# EAGLE design Main Board Germany 2016 (EAGLE 7.6.0)
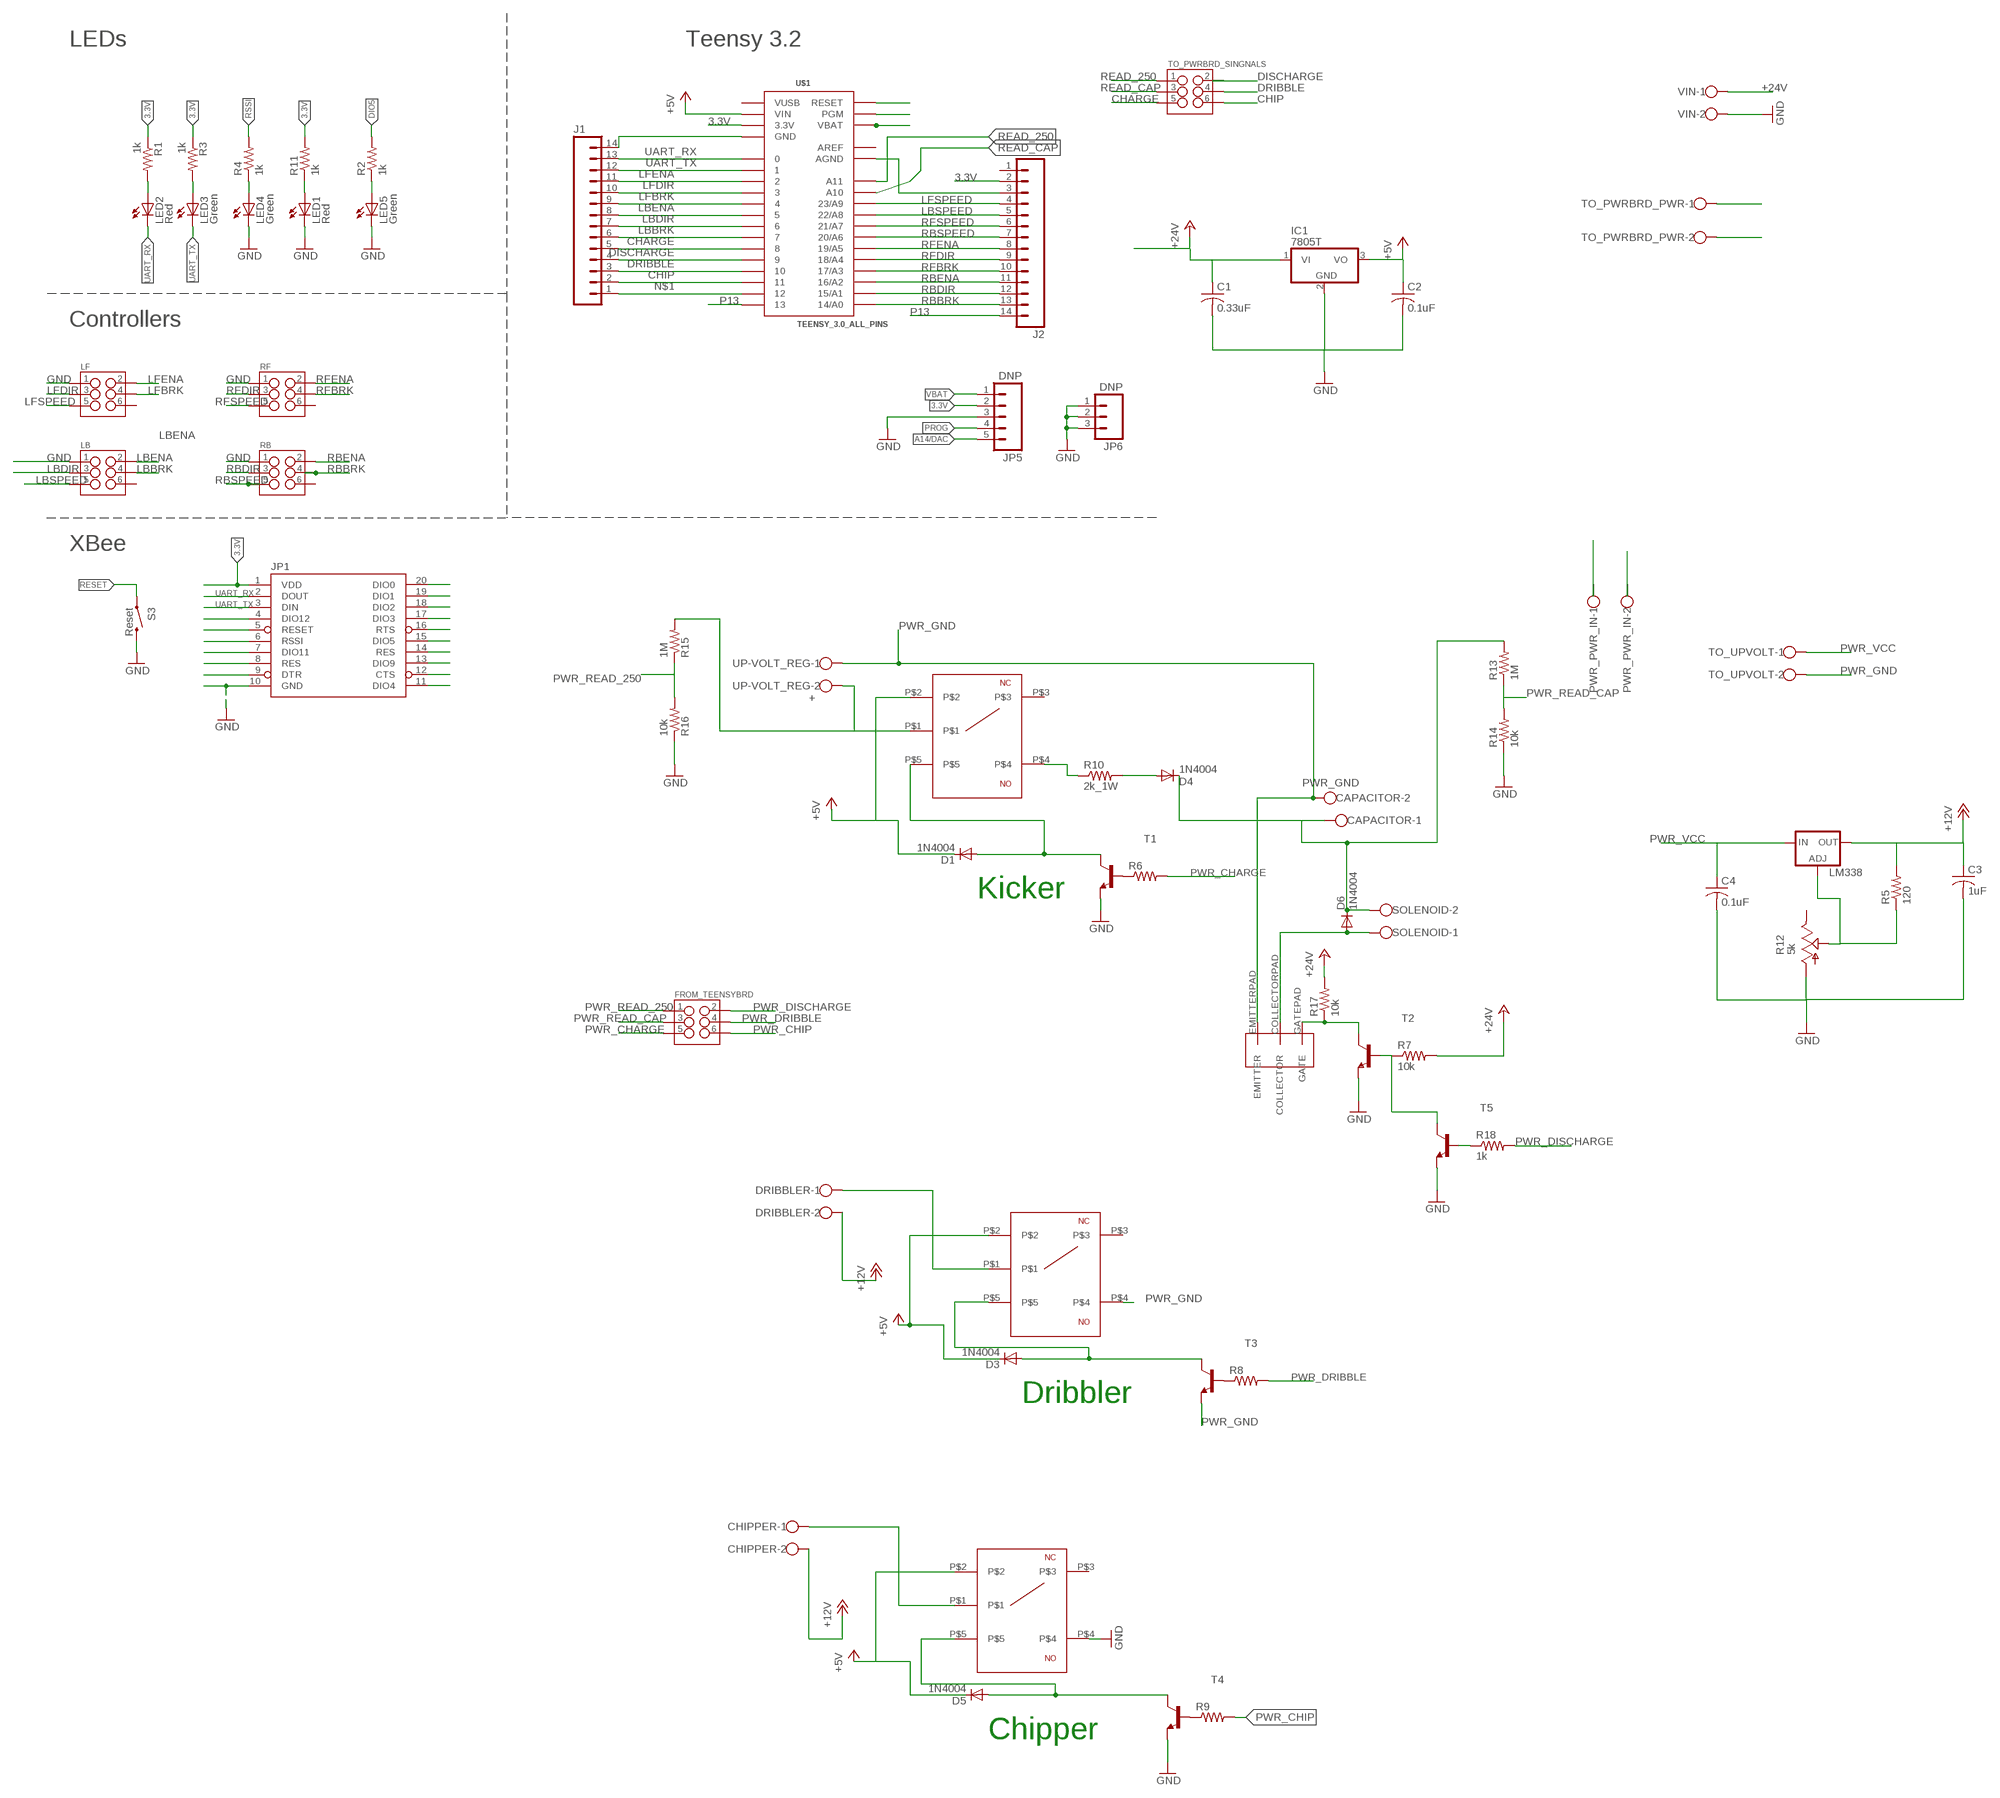
[diagram p0: schematic, sheet 1]

## Parts
C1  0.33uF  C-USC0805  [C0805]
C2  0.1uF  C-USC0805  [C0805]
C3  1uF  C-USC0805  [C0805]
C4  0.1uF  C-USC0805  [C0805]
CAPACITOR  W237-102  [W237-102]
CHIPPER  W237-102  [W237-102]
D1  1N4004  [DO41-10]
D3  1N4004  [DO41-10]
D4  1N4004  [DO41-10]
D5  1N4004  [DO41-10]
D6  1N4004  [DO41-10]
DRIBBLER  W237-102  [W237-102]
FROM_TEENSYBRD  M03X2POGO_PINS  [2X3_POGO]
IC1  7805T  [TO220H]
J1  M14  [1X14]
J2  M14  [1X14]
JP1  XBEE-1B1  [XBEE-1]
JP5  DNP  M05PTH  [1X05]
JP6  DNP  M03PTH  [1X03]
LB  M03X2POGO_PINS  [2X3_POGO]
LED1  Red  LED-RED0603  [LED-0603]
LED2  Red  LED-RED0603  [LED-0603]
LED3  Green  LED-GREEN0603  [LED-0603]
LED4  Green  LED-GREEN0603  [LED-0603]
LED5  Green  LED-GREEN0603  [LED-0603]
LF  M03X2POGO_PINS  [2X3_POGO]
LM338  LM317TL  [317TL]
PWR_PWR_IN  W237-102  [W237-102]
R1  1k  1KOHM1/10W1%(0603)  [0603-RES]
R2  1k  1KOHM1/10W1%(0603)  [0603-RES]
R3  1k  1KOHM1/10W1%(0603)  [0603-RES]
R4  1k  1KOHM1/10W1%(0603)  [0603-RES]
R5  120  R-US_M0805  [M0805]
R6  R-US_0207/7  [0207/7]
R7  10k  R-US_0207/7  [0207/7]
R8  R-US_0207/7  [0207/7]
R9  R-US_0207/7  [0207/7]
R10  2k_1W  R-US_0309/12  [0309/12]
R11  1k  1KOHM1/10W1%(0603)  [0603-RES]
R12  5k  TRIM_US-B25P  [B25P]
R13  1M  R-US_M0805  [M0805]
R14  10k  R-US_M0805  [M0805]
R15  1M  R-US_M0805  [M0805]
R16  10k  R-US_M0805  [M0805]
R17  10k  R-US_0207/7  [0207/7]
R18  1k  R-US_0207/7  [0207/7]
RB  M03X2POGO_PINS  [2X3_POGO]
RF  M03X2POGO_PINS  [2X3_POGO]
S3  Reset  SWITCH-MOMENTARY-2SMD  [TACTILE-SWITCH-SMD]
SOLENOID  W237-102  [W237-102]
T1  2N3904-NPN-TO92-EBC  [TO92-EBC]
T2  2N3904-NPN-TO92-EBC  [TO92-EBC]
T3  2N3904-NPN-TO92-EBC  [TO92-EBC]
T4  2N3904-NPN-TO92-EBC  [TO92-EBC]
T5  2N3904-NPN-TO92-EBC  [TO92-EBC]
TO_PWRBRD_PWR  W237-102  [W237-102]
TO_PWRBRD_SINGNALS  M03X2POGO_PINS  [2X3_POGO]
TO_UPVOLT  W237-102  [W237-102]
U$1  TEENSY_3.0_ALL_PINS  [TEENSY3-ALL_PINS]
U$2  APT75GN120LG  [TO-264]
U$3  PANASONIC_JS1  [PANASONIC_JS1]
U$4  PANASONIC_JS1  [PANASONIC_JS1]
U$5  PANASONIC_JS1  [PANASONIC_JS1]
UP-VOLT_REG  +  W237-102  [W237-102]
VIN  W237-102  [W237-102]

## Nets
3.3V: J2.2 JP1.1(VDD) JP5.2 R1.1 R3.1 R11.2 U$1.3.3V U$1.3.3V1(3.3V)
+5V: C2.1 D1.C D3.C D5.C IC1.3(VO) U$1.VIN U$3.P$2 U$4.P$2 U$5.P$2
+12V: C3.1 CHIPPER.2 DRIBBLER.2 LM338.2(OUT) R5.2
+24V: C1.1 IC1.1(VI) R7.2 R17.2 TO_PWRBRD_PWR.1 VIN.1
A14/DAC: JP5.5 U$1.RESET/DAC(RESET)
CHARGE: J1.5 TO_PWRBRD_SINGNALS.P$5 U$1.8
CHIP: J1.2 TO_PWRBRD_SINGNALS.P$6 U$1.11
CTS: JP1.12(CTS)
DIO0: JP1.20(DIO0)
DIO1: JP1.19(DIO1)
DIO2: JP1.18(DIO2)
DIO3: JP1.17(DIO3)
DIO4: JP1.11(DIO4)
DIO5: JP1.15(DIO5) R2.2
DIO9: JP1.13(DIO9)
DIO11: JP1.7(DIO11)
DIO12: JP1.4(DIO12)
DISCHARGE: J1.4 U$1.9
DRIBBLE: J1.3 TO_PWRBRD_SINGNALS.P$4 U$1.10
DTR: JP1.9(DTR)
GND: C1.2 C2.2 C3.2 C4.2 IC1.2(GND) J1.14 JP1.10(GND) JP5.3 JP6.1 JP6.2 JP6.3 LB.P$1 LED1.C LED4.C LED5.C LF.P$1 R12.A R14.1 R16.1 RB.P$1 RF.P$1 S3.3 T1.E T2.E T4.E T5.E TO_PWRBRD_PWR.2 U$1.GND U$1.GND1(GND) U$5.P$4 VIN.2
LBBRK: J1.6 LB.P$4 U$1.7
LBDIR: J1.7 LB.P$3 U$1.6
LBENA: J1.8 LB.P$2 U$1.5
LBSPEED: J2.5 LB.P$5 U$1.22/A8
LFBRK: J1.9 LF.P$4 U$1.4
LFDIR: J1.10 LF.P$3 U$1.3
LFENA: J1.11 LF.P$2 U$1.2
LFSPEED: J2.4 LF.P$5 U$1.23/A9
N$1: J1.1 U$1.12
N$2: LM338.1(ADJ) R5.1 R12.S
N$3: R18.1 T5.B
N$4: R7.1 T2.B T5.C
N$5: R17.1 T2.C U$2.GATEPAD(GATE)
N$6: D1.A T1.C U$3.P$5
N$8: D3.A T3.C U$4.P$5
N$9: D4.A R10.2
N$10: R10.1 U$3.P$4
N$11: D6.A SOLENOID.1 U$2.COLLECTORPAD(COLLECTOR)
N$12: LED1.A R11.1
N$13: CAPACITOR.1 D4.C D6.C R13.2 SOLENOID.2
N$14: R15.2 U$3.P$1 UP-VOLT_REG.2
N$15: R6.1 T1.B
N$17: LED2.A R1.2
N$18: J2.3 U$1.AGND
N$19: LED3.A R3.2
N$20: R8.1 T3.B
N$22: DRIBBLER.1 U$4.P$1
N$24: D5.A T4.C U$5.P$5
N$26: R9.1 T4.B
N$28: CHIPPER.1 U$5.P$1
N$43: LED4.A R4.1
N$139: LED5.A R2.1
P13: J2.14 U$1.13
PROG: JP5.4 U$1.PGM
PWR_CHARGE: FROM_TEENSYBRD.P$5 R6.2
PWR_CHIP: FROM_TEENSYBRD.P$6 R9.2
PWR_DISCHARGE: FROM_TEENSYBRD.P$2 R18.2
PWR_DRIBBLE: FROM_TEENSYBRD.P$4 R8.2
PWR_GND: CAPACITOR.2 T3.E TO_UPVOLT.2 U$2.EMITTERPAD(EMITTER) U$4.P$4 UP-VOLT_REG.1
PWR_READ_250: FROM_TEENSYBRD.P$1 R15.1 R16.2
PWR_READ_CAP: FROM_TEENSYBRD.P$3 R13.1 R14.2
PWR_VCC: C4.1 LM338.3(IN) TO_UPVOLT.1
RBBRK: J2.13 RB.P$4 U$1.14/A0
RBDIR: J2.12 RB.P$3 U$1.15/A1
RBENA: J2.11 RB.P$2 U$1.16/A2
RBSPEED: J2.7 RB.P$5 U$1.20/A6
READ_250: TO_PWRBRD_SINGNALS.P$1 U$1.A11
READ_CAP: TO_PWRBRD_SINGNALS.P$3 U$1.A10
RES: JP1.8(RES)
RES2: JP1.14(RES)
RESET: JP1.5(RESET) S3.1
RFBRK: J2.10 RF.P$4 U$1.17/A3
RFDIR: J2.9 RF.P$3 U$1.18/A4
RFENA: J2.8 RF.P$2 U$1.19/A5
RFSPEED: J2.6 RF.P$5 U$1.21/A7
RSSI: JP1.6(RSSI) R4.2
RTS: JP1.16(RTS)
UART_RX: J1.13 JP1.2(DOUT) LED2.C U$1.0
UART_TX: J1.12 JP1.3(DIN) LED3.C U$1.1
VBAT: JP5.1 U$1.VBAT
Unconnected: J2.1 LB.P$6 LF.P$6 PWR_PWR_IN.1 PWR_PWR_IN.2 R12.E RB.P$6 RF.P$6 TO_PWRBRD_SINGNALS.P$2 U$3.P$3 U$4.P$3 U$5.P$3

## Notes on the sheet
- LEDs | Teensy 3.2
- Controllers
- XBee
- Kicker
- Dribbler
- Chipper

## Power pins joined to a net without a drawn wire
AREF: U$1.AREF
VUSB: U$1.VUSB

## Library data of the parts
C1-C4 = adafruit:C-US: CAPACITOR, American symbol
CAPACITOR CHIPPER DRIBBLER PWR_PWR_IN SOLENOID TO_PWRBRD_PWR TO_UPVOLT UP-VOLT_REG VIN = con-wago-500:W237-102: WAGO SCREW CLAMP; MPN: 237-102; OC_FARNELL: unknown; OC_NEWARK: 70K9898
D1 D3-D6 = diode:1N4004: DIODE general purpose rectifier, 1 A
FROM_TEENSYBRD LB LF RB RF TO_PWRBRD_SINGNALS = SparkFun-Connectors:M03X2: 2x3 .1" header. Shrouded, with keying- CONN-10681 SMT- CONN-11415 Pogo pins- HW-11044; PROD_ID: HW-11044
IC1 = linear:78*: Positive VOLTAGE REGULATOR Source: http://cache.national.com/ds/LM/LM78L05.pdf http://www.fairchildsemi.com/ds/LM/LM7805.pdf
J1 J2 = SparkFun-Connectors:M14: Header 14 Standard 14-pin 0.1" header. Use with straight break away headers (SKU : PRT-00116), right angle break away headers (PRT-00553), swiss pins (PRT-00743), machine pins (PRT-00117), and female headers (PRT-00115).
JP1 = SparkFun-RF:XBEE-1: Xbee module footprints
JP5 = SparkFun-Connectors:M05: Header 5 Standard 5-pin 0.1" header. Use with straight break away headers (SKU : PRT-00116), right angle break away headers (PRT-00553), swiss pins (PRT-00743), machine pins (PRT-00117), and female headers (PRT-00115). Molex polarized connector foot print use with SKU : PRT-08230 with associated crimp pins and housings.
JP6 = SparkFun-Connectors:M03: Header 3 Standard 3-pin 0.1" header. Use with straight break away headers (SKU : PRT-00116), right angle break away headers (PRT-00553), swiss pins (PRT-00743), machine pins (PRT-00117), and female headers (PRT-00115). Molex polarized connector foot print use with SKU : PRT-08232 with associated crimp pins and housings.
LED1 LED2 = SparkFun-LED:LED-RED: Assorted Red LEDs LilyPad 1206- DIO-09912 1206- DIO-00809 0603- DIO-00819; PROD_ID: DIO-00819; VALUE: RED
LED3-LED5 = SparkFun-LED:LED-GREEN: Various green LEDs Green LEDs used in SFE Production 0603- DIO-00821 LARGE- DIO-00862 LILYPAD- DIO-09910; PROD_ID: DIO-00821; VALUE: GREEN
LM338 = v-reg:LM317TL: VOLTAGE REGULATOR
R1-R4 R11 = SparkFun-Resistors:1KOHM1/10W1%(0603): RES-07856; PROD_ID: RES-07856; VALUE: 1K
R5-R10 R13-R18 = resistor:R-US_: RESISTOR, American symbol
R12 = pot:TRIM_US-: POTENTIOMETER
S3 = SparkFun-Electromechanical:SWITCH-MOMENTARY-2: Various NO switches- pushbuttons, reed, etc; PROD_ID: SWCH-08247
T1-T5 = transistor-neu-to92:*-NPN-: NPN Transistror
U$1 = Teensy_3_and_LC_Series_Boards_v1.1:TEENSY_3.0_ALL_PINS: Teensy 3.0 board, showing all pins that are easily acessible. See 'AllAnalogPins" and 'AllPins' packages for additional pin holes, as needed. The 'Basic' package has fewer pins.
U$2 = igbt:APT75GN120LG
U$3-U$5 = RoboBulls_relay:PANASONIC_JS1

## Net classes
0 default: width 0.203 mm
1 vcc: width 0.254 mm

## Board
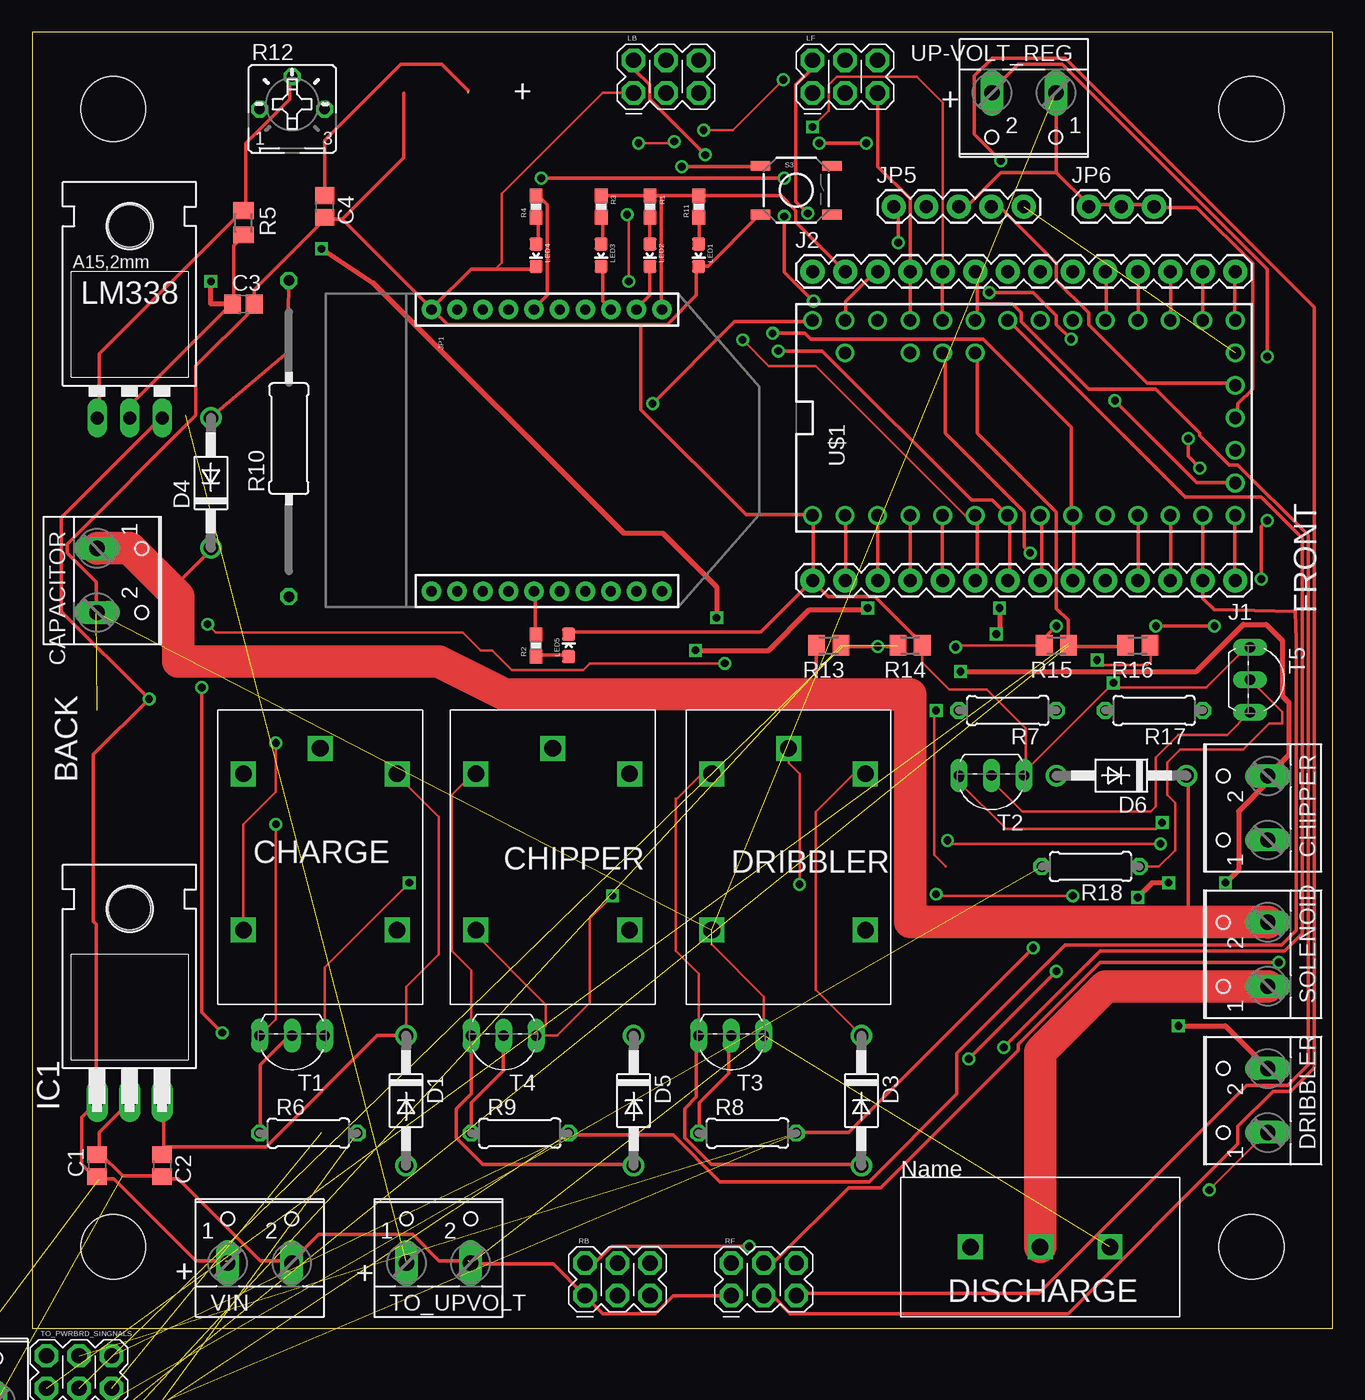
[diagram p1: board, top side]
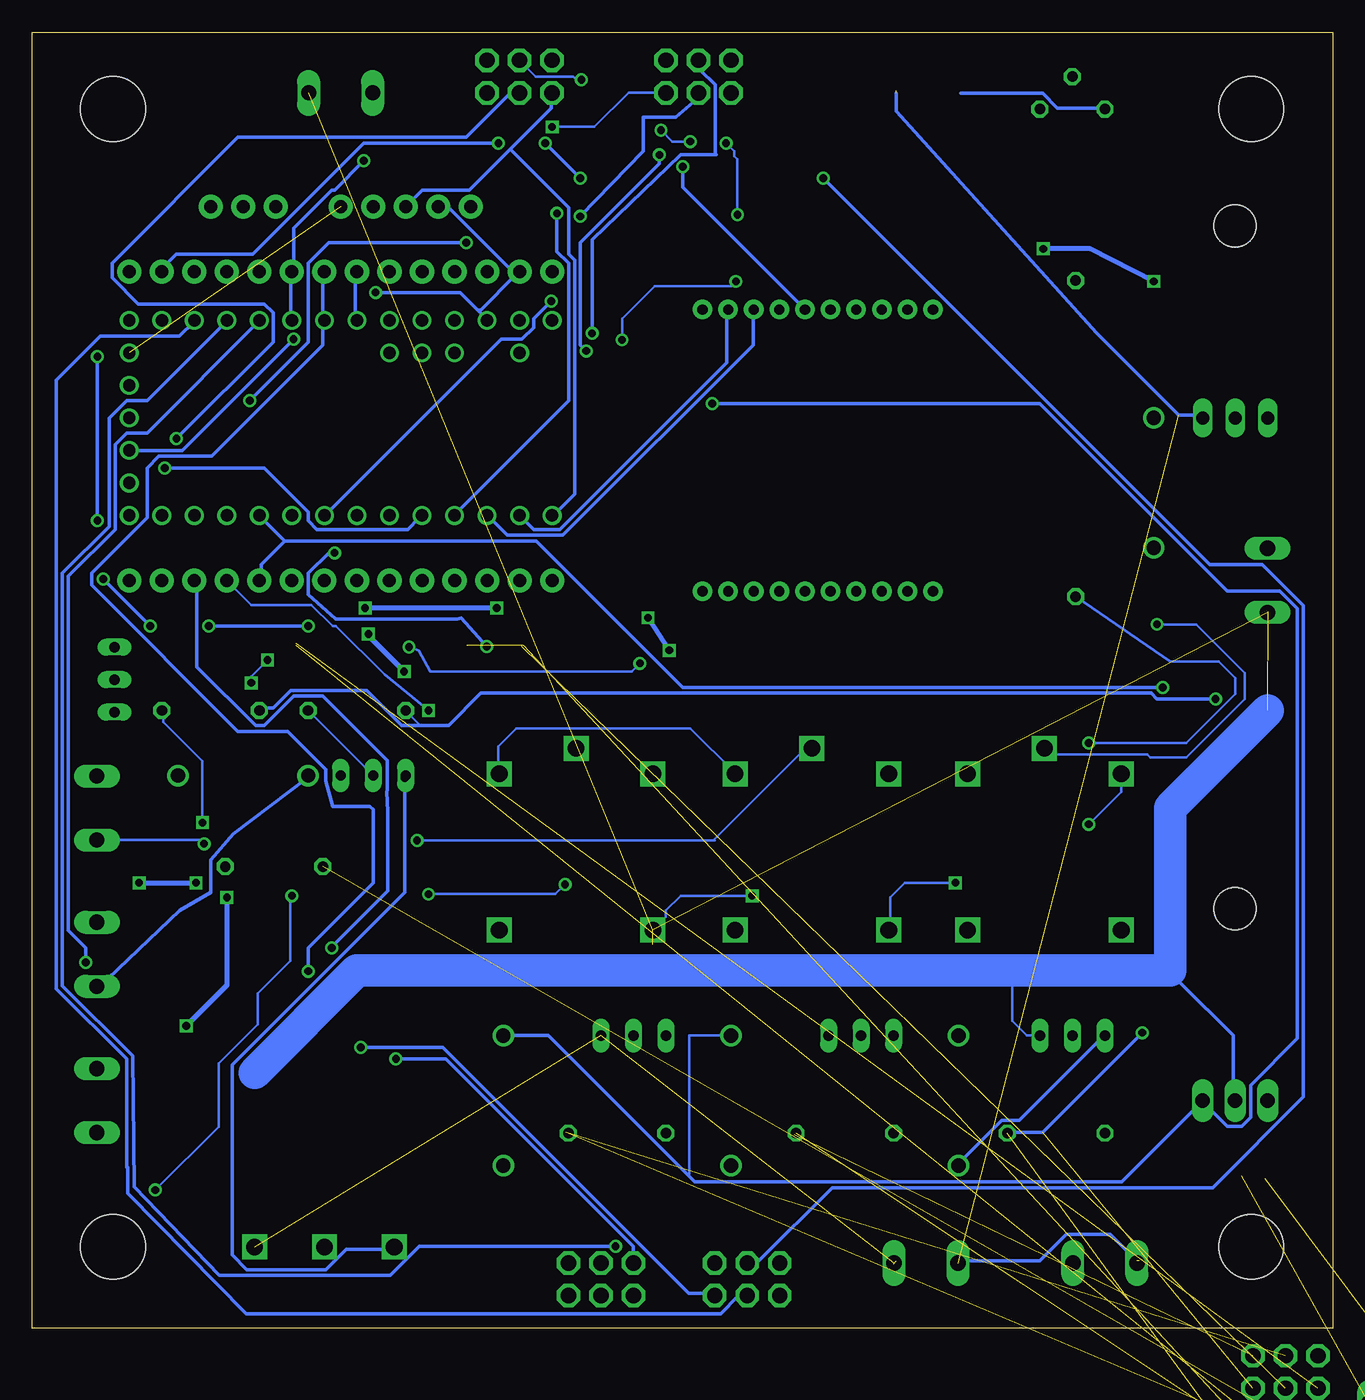
[diagram p2: board, bottom side, seen from below]

Size 101.58 x 101.27 mm. Coordinates in mm from the lower left corner, seen from the top.
Outline: 0,0 101.58,0 101.58,101.27 0,101.27 0,0
Copper layers (1*16): Top 0.035mm / dielectric 1.5mm / Bottom 0.035mm
Design rules "default": minimum track width 10mil, minimum drill 24mil, track to track 8mil, track to pad 8mil, pad to pad 8mil, via to via 8mil, smd to smd 8mil, copper to edge 40mil, drill to drill 8mil, minimum pad ring 10mil, minimum via ring 8mil, stop-mask expansion 4mil, vias tented up to drill 0mil, thermal gap 10mil
Holes 5.08 mm at 6.35,6.35 95.25,6.35 6.35,95.25 95.25,95.25

### Footprints (pad centres in the part's own frame; a part is rotated, then mirrored left to right if it is on the bottom)
C0805 = smd 1.3 x 1.5: 1 -0.85,0; 2 0.85,0
W237-102 = drill 1.194 long: 1 -2.5,-1.27; 2 2.5,-1.27
DO41-10 = drill 1.118: A 5.08,0; C -5.08,0
2X3_POGO = drill 1.2 pad 1.829 octagon: P$1 0,0; P$2 0,2.54; P$3 2.54,0; P$4 2.54,2.54; P$5 5.08,0; P$6 5.08,2.54
TO220H = drill 1.118 long: 1 -2.54,-10.16; 2 0,-10.16; 3 2.54,-10.16 | hole 3.302: 0,4.826
1X14 = drill 1.016 pad 1.88: 1 0,0; 2 2.54,0; 3 5.08,0; 4 7.62,0; 5 10.16,0; 6 12.7,0; 7 15.24,0; 8 17.78,0; 9 20.32,0; 10 22.86,0; 11 25.4,0; 12 27.94,0; 13 30.48,0; 14 33.02,0
XBEE-1 = drill 0.8 pad 1.524: 1 -11,20; 2 -11,18; 3 -11,16; 4 -11,14; 5 -11,12; 6 -11,10; 7 -11,8; 8 -11,6; 9 -11,4; 10 -11,2; 11 11,2; 12 11,4; 13 11,6; 14 11,8; 15 11,10; 16 11,12; 17 11,14; 18 11,16; 19 11,18; 20 11,20
1X05 = drill 1.016 pad 1.88: 1 0,0; 2 2.54,0; 3 5.08,0; 4 7.62,0; 5 10.16,0
1X03 = drill 1.016 pad 1.88: 1 0,0; 2 2.54,0; 3 5.08,0
LED-0603 = smd 1 x 1: A 0,-0.877; C 0,0.877
317TL = drill 1.016 long: 1 -2.54,-3.81; 2 0,-3.81; 3 2.54,-3.81 | hole 3.302: 0,11.176
0603-RES = smd 1.1 x 1: 1 -0.85,0; 2 0.85,0
M0805 = smd 1.3 x 1.6: 1 -0.95,0; 2 0.95,0
0207/7 = drill 0.813 octagon: 1 -3.81,0; 2 3.81,0
0309/12 = drill 0.813 octagon: 1 -6.35,0; 2 18.35,0
B25P = drill 0.813 octagon: A -2.54,0; E 2.54,0; S 0,2.54
TACTILE-SWITCH-SMD = smd 1.524 x 0.762: 1 -2.794,1.905; 2 2.794,1.905; 3 -2.794,-1.905; 4 2.794,-1.905
TO92-EBC = drill 0.813 long: B 0,-1.27; C 2.54,-1.27; E -2.54,-1.27
TEENSY3-ALL_PINS = drill 0.965: 0 -7.62,13.97; 1 -7.62,11.43; 2 -7.62,8.89; 3 -7.62,6.35; 3.3V 7.62,11.43; 3.3V1 -2.54,-16.51; 4 -7.62,3.81; 5 -7.62,1.27; 6 -7.62,-1.27; 7 -7.62,-3.81; 8 -7.62,-6.35; 9 -7.62,-8.89; 10 -7.62,-11.43; 11 -7.62,-13.97; 12 -7.62,-16.51; 13 7.62,-16.51; 14/A0 7.62,-13.97; 15/A1 7.62,-11.43; 16/A2 7.62,-8.89; 17/A3 7.62,-6.35; 18/A4 7.62,-3.81; 19/A5 7.62,-1.27; 20/A6 7.62,1.27; 21/A7 7.62,3.81; 22/A8 7.62,6.35; 23/A9 7.62,8.89; A10 5.08,6.35; A11 5.08,3.81; AGND 7.62,13.97; AREF 5.08,8.89; GND -7.62,16.51; GND1 0,-16.51; PGM 2.54,-16.51; RESET/DAC 5.08,-16.51; VBAT -5.08,-16.51; VIN 7.62,16.51; VUSB 5.08,13.97
TO-264 = drill 1.295 square: COLLECTORPAD 0,0; EMITTERPAD 5.45,0; GATEPAD -5.45,0
PANASONIC_JS1 = drill 1.3 square: P$1 -2,6; P$2 0,12; P$3 12.2,12; P$4 12.2,0; P$5 0,0

### Placement (x,y rotation side)
C1  5.08,12.7 90 top
C2  10.16,12.7 270 top
C3  16.51,80.01 0 top
C4  22.86,87.63 270 top
CAPACITOR  6.35,58.42 270 top
CHIPPER  95.25,40.64 90 top
D1  29.21,17.78 270 top
D3  64.77,17.78 270 top
D4  13.97,66.04 90 top
D5  46.99,17.78 270 top
D6  85.09,43.18 180 top
DRIBBLER  95.25,17.78 90 top
FROM_TEENSYBRD  1.14,-11.05 0 top  (outside the outline)
IC1  7.62,27.94 0 top
J1  93.98,58.42 180 top
J2  60.96,82.55 0 top
JP1  29.21,68.58 270 top
JP5  67.31,87.63 0 top
JP6  82.55,87.63 0 top
LB  46.99,96.52 0 top
LED1  52.07,83.82 180 top
LED2  48.26,83.82 180 top
LED3  44.45,83.82 180 top
LED4  39.37,83.82 180 top
LED5  41.91,53.34 0 top
LF  60.96,96.52 0 top
LM338  7.62,74.93 0 top
PWR_PWR_IN  -15.49,-4.57 0 top  (outside the outline)
R1  48.26,87.63 270 top
R2  39.37,53.34 90 top
R3  44.45,87.63 270 top
R4  39.37,87.63 90 top
R5  16.51,86.36 270 top
R6  21.59,15.24 0 top
R7  76.2,48.26 180 top
R8  55.88,15.24 0 top
R9  38.1,15.24 0 top
R10  20.07,63.5 90 top
R11  52.07,87.63 90 top
R12  20.32,95.25 0 top
R13  62.23,53.34 180 top
R14  68.58,53.34 180 top
R15  80.01,53.34 180 top
R16  86.36,53.34 180 top
R17  87.63,48.26 180 top
R18  82.68,36.07 180 top
RB  43.18,2.54 0 top
RF  54.61,2.54 0 top
S3  59.69,88.9 0 top
SOLENOID  95.25,29.21 90 top
T1  20.32,21.59 180 top
T2  74.93,41.91 180 top
T3  54.61,21.59 180 top
T4  36.83,21.59 180 top
T5  96.39,50.67 270 top
TO_PWRBRD_PWR  -5.33,-4.57 0 top  (outside the outline)
TO_PWRBRD_SINGNALS  1.14,-4.7 0 top
TO_UPVOLT  31.75,6.35 0 top
U$1  77.47,71.12 90 top
U$2  78.74,6.35 0 top
U$3  16.51,43.31 270 top
U$4  53.09,43.31 270 top
U$5  34.67,43.31 270 top
UP-VOLT_REG  77.47,95.25 180 top
VIN  17.78,6.35 0 top

### Tracks (layer width: path | path; a pad name or v marks a point on that pad's centre or on a via)
3.3V  (via drill 0.61)
  Top 0.254: R3.1 44.58,88.47 48.23,88.47 R1.1 48.46,88.47 49.15,88.47 | 49.15,88.47 51.89,88.47 R11.2 52.12,88.47 58.52,88.47 59.66,87.33 59.66,86.41 63.32,82.75 J2.2 | 49.15,88.47 49.15,79.78 JP1.1 | v81.15,77.27 80.01,78.41 80.01,79.1 78.18,80.92 v74.75,80.92
  Bottom 0.254: U$1.3.3V1 89.84,68.58 v81.15,77.27 | v74.75,80.92 68.12,80.92 66.75,79.55 | 66.75,79.55 66.06,78.87 U$1.3.3V | 63.78,82.3 66.52,79.55 66.75,79.55 | 63.78,82.3 63.55,82.53 J2.2 63.78,82.3 | 63.78,82.3 69.04,87.55 69.72,87.55 JP5.2
+5V  (via drill 0.61)
  Top 0.203: D1.C 29.21,26.67 31.75,29.21 31.75,39.94 28.51,43.18 U$3.P$2 | D3.C 61.21,26.42 61.21,40.32 64.2,43.31 U$4.P$2
  Top 0.254: 10.29,14.17 10.29,17.6 IC1.3 | 10.29,14.17 10.29,13.72 C2.1 10.29,14.17 | v48.46,72.24 54.86,78.64 60.81,78.64 U$1.VIN | D1.C 26.98,22.86 18.29,14.17 10.29,14.17
  Bottom 0.203: D5.C 50.25,22.86 50.25,11.85 | U$5.P$2 46.67,43.37 50.16,46.86 63.75,46.86 65.15,45.47 65.15,43.37 U$4.P$2
  Bottom 0.254: v48.46,72.24 22.86,72.24 8.23,57.61 4.12,57.61 2.74,56.24 2.74,22.63 6.4,18.97 6.4,16.46 7.09,15.77 8.23,15.77 10.06,17.6 IC1.3 10.29,17.6 16.46,11.43 49.84,11.43 50.25,11.85 61.27,22.86 D3.C
+12V  (via drill 0.6)
  Top 0.254: R5.2 16.46,85.27 15.77,84.58 15.77,80.01 C3.1 15.54,80.01 7.77,72.24 7.77,71.32 LM338.2
  Top 0.406: 15.77,80.01 13.97,80.01 v13.97,81.79 | v22.61,84.33 26.67,81.66 46.23,62.1 49.28,62.1 53.47,57.91 v53.47,55.5 | v51.82,52.96 57.53,52.96 60.71,56.13 65.15,56.13 v65.28,56.26 | v75.56,56.26 75.56,54.48 v75.31,54.23 | v72.52,51.31 90.93,51.31 94.61,54.99 96.39,54.99 97.66,53.72 97.66,49.4 98.17,48.9 98.17,44.79 CHIPPER.2 96.52,42.67 94.23,40.39 94.23,35.81 v93.22,34.8 | v88.77,34.8 87.5,34.8 v86.36,33.66 | v89.53,23.62 93.18,23.62 DRIBBLER.2
  Bottom 0.406: v13.97,81.79 18.92,84.33 v22.61,84.33 | v53.47,55.5 v51.82,52.96 | v65.28,56.26 75.31,56.26 75.44,56.39 v75.56,56.26 | v75.31,54.23 75.31,54.1 v72.52,51.31 | v93.22,34.8 v88.77,34.8 | v86.36,33.66 86.36,26.8 v89.53,23.62
+24V  (via drill 0.61)  (2 unrouted)
  Top 0.254: 15.09,5.26 12.8,5.26 6.4,11.66 5.26,11.66 C1.1 5.03,11.89 4.57,12.34 4.34,12.34 3.89,12.8 3.89,16.46 5.03,17.6 IC1.1 5.03,17.83 5.03,31.55 4.8,31.77 4.8,44.81 v9.14,49.15 2.29,56.01 2.29,63.32 10.06,71.09
  Bottom 0.203: R7.2 72.39,48.23 71.25,47.09
  Bottom 0.254: v9.14,49.15 13.72,49.15 14.17,49.61 66.52,49.61 69.04,47.09 71.25,47.09 72.69,47.09 75.44,49.84 81.38,49.84 82.75,48.46 83.67,48.46 R17.2 | 29.03,5.26 22.86,5.26 20.8,7.32 17.37,7.32 15.32,5.26 VIN.1
A14/DAC  (1 unrouted)
CHARGE  (via drill 0.61)  (1 unrouted)
  Top 0.254: v14.86,23.09 13.26,24.69 v13.26,50.06
  Bottom 0.254: 25.38,15.32 22.63,15.32 v14.86,23.09 | v13.26,50.06 50.75,50.06 62.18,61.49 81.84,61.49 | 81.84,61.49 83.67,63.32 U$1.8 | 81.84,61.49 83.67,59.66 83.67,58.52 J1.5
CHIP  (1 unrouted)
  Top 0.254: 42.06,15.09 50.06,15.09 53.72,11.43 65.38,11.43 72.24,18.29 72.24,21.49 80.7,29.95 97.61,29.95 98.75,31.09 98.75,53.77 98.68,56.01 92.33,56.13 91.44,57.02 J1.2 U$1.11
DIO5
  Top 0.254: R2.2 39.32,54.41 39.32,57.38 JP1.15
DISCHARGE  (via drill 0.6)
  Top 0.203: 71.37,36.07 70.48,36.96 70.48,48.64 v70.61,48.26
  Top 0.254: U$1.9 86.41,63.32 86.41,58.52 J1.4
  Bottom 0.203: v70.61,48.26 74.04,51.05 77.85,54.86 78.11,54.86 79.76,56.52 84.45,56.52 J1.4
DRIBBLE  (via drill 0.61)  (1 unrouted)
  Top 0.254: 59.89,15.32 63.78,15.32 v78.18,29.72 | U$1.10 88.92,63.32 88.92,58.52 J1.3
  Bottom 0.254: v78.18,29.72 78.18,29.77 73.79,34.16 73.79,40.39 73.86,41.91 73.84,42.06 73.84,44.35 78.87,49.38 81.15,49.38 83.44,47.09 84.12,47.09 88.7,51.66 88.7,58.29 J1.3
GND  (via drill 0.6)  (4 unrouted)
  Top 0.203: T1.E 22.86,28.19 v29.46,34.8 | v45.34,33.78 43.56,32 43.56,25.4 41.02,22.86 T4.E 40.13,23.62 40.13,25.27 34.42,30.98 34.54,30.98 U$5.P$4 | LB.P$1 44.58,96.52 36.7,88.65 36.7,83.26 36.2,82.75 | v83.19,52.2 83.57,51.82 87.12,51.82 87.38,52.07 87.38,53.27 R16.1 | T5.E 94.87,53.21 91.69,50.04 84.84,50.04 v84.45,50.42 77.47,43.43 T2.E 77.6,43.31 77.6,46.86 74.55,49.91 71.63,49.91 69.53,52.01 R14.1
  Top 0.254: 34.29,5.03 40.69,5.03 RB.P$1 44.58,1.14 48.69,1.14 50.06,2.52 54.41,2.52 RF.P$1 | 5.26,13.72 5.26,15.32 7.54,17.6 IC1.2 | 5.26,13.72 7.09,11.89 10.06,11.89 C2.2 10.29,11.66 11.43,11.66 17.83,5.26 20.12,5.26 VIN.2 20.34,5.26 22.4,7.32 29.72,7.32 31.77,5.26 34.06,5.26 | 5.26,13.72 C1.2 | 80.01,90.3 80.01,96.47 | 80.01,90.3 82.53,87.78 JP6.1 82.75,87.78 85.04,87.78 JP6.2 85.27,87.78 87.55,87.78 JP6.3 87.78,87.55 90.98,87.55 95.33,83.21 95.33,73.38 94.18,72.24 94.18,71.32 U$1.GND1 | 80.01,90.3 75.67,90.3 73.15,87.78 72.47,87.78 JP5.3 | LED5.C 42.06,54.41 56.92,54.41 60.81,58.29 J1.14 | R14.1 69.49,53.49 65.84,57.15 62.18,57.15 61.04,58.29 J1.14 | J1.14 61.04,58.52 61.04,63.32 U$1.GND 60.81,63.55 55.78,63.55 47.55,71.78 47.55,78.41 | 22.86,86.64 17.37,81.15 17.37,80.01 C3.2 17.14,80.01 17.14,79.55 12.8,75.21 12.8,71.32 2.74,61.27 2.74,60.58 5.03,58.29 5.03,56.01 | S3.3 56.69,86.87 52.81,82.98 52.12,82.98 LED1.C 51.89,82.75 51.89,80.7 49.61,78.41 47.55,78.41 | LED4.C 39.32,82.75 36.2,82.75 34.29,82.75 31.32,79.78 JP1.10 | 47.55,78.41 32.46,78.41 31.32,79.55 JP1.10 | 24.23,86.64 22.86,86.64 | 24.23,86.64 31.09,79.78 JP1.10 | 22.86,86.64 C4.2 | 29.03,96.47 29.03,91.44 24.23,86.64
  Bottom 0.203: v29.46,34.8 33.4,34.8 34.54,33.66 34.54,31.23 U$5.P$4 | v45.34,33.78 50.93,33.78 52.07,32.64 52.07,32.12 | T1.E 23.88,22.86 25.02,24 25.02,27.05 25.15,27.18 25.15,27.81 25.27,27.94 | v84.45,50.42 84.45,50.93 v83.19,52.2
  Bottom 0.254: IC1.2 7.77,17.83 7.77,22.86 11.89,26.98 12.7,27.94 | 64.24,92.13 67.44,88.92 71.09,88.92 JP5.3 | 64.24,92.13 61.04,95.33 61.04,96.47 LF.P$1 | 29.03,96.47 22.63,96.47 21.49,95.33 17.83,95.33 R12.A | 64.24,92.13 59.66,87.55 59.66,83.9 59.21,83.44 59.21,65.15 60.81,63.55 U$1.GND
  Bottom 2.54: 84.19,19.95 76.2,27.94 25.27,27.94 12.7,27.94 12.7,40.64 5.08,48.26
LBBRK  (via drill 0.61)
  Top 0.254: J1.6 81.38,58.52 81.38,63.32 U$1.7 81.15,63.55 81.15,70.41 74.3,77.27 60.81,77.27 60.35,77.72 v57.84,77.72
  Bottom 0.254: v57.84,77.72 57.84,85.04 50.93,91.69 48.13,91.69 48.23,91.8 48.23,97.16 49.38,98.3 49.38,98.98 LB.P$4
LBDIR  (via drill 0.61)
  Top 0.254: U$1.6 78.87,63.32 78.87,58.52 J1.7 | v58.75,86.87 58.75,82.53 v61.04,80.24
  Bottom 0.254: v58.75,86.87 53.85,91.95 53.85,94.61 51.31,94.61 49.66,96.01 49.61,96.01 49.61,96.47 LB.P$3 | v61.04,80.24 62.41,78.87 62.41,78.18 63.32,77.27 64.92,77.27 78.64,63.55 U$1.6
LBENA  (via drill 0.61)
  Top 0.254: J1.8 76.35,58.52 76.35,63.32 U$1.5 76.12,63.55 74.98,64.69 73.38,64.69 61.72,76.35 v58.29,76.35 | v52.58,91.67 48.23,96.01 48.23,97.16 47.09,98.3 47.09,98.98 LB.P$2
  Bottom 0.254: v52.58,91.67 52.58,90.98 58.75,84.81 58.75,76.81 v58.29,76.35
LBSPEED  (via drill 0.6)
  Top 0.203: J2.5 71.12,95.76 69.09,97.79 62.87,97.79 62.23,97.16 62.23,95.12 v60.96,93.85
  Top 0.254: U$1.22/A8 71.09,78.87 71.09,82.53 J2.5
  Bottom 0.203: v60.96,93.85 57.66,93.85 54.99,96.52 LB.P$5
LFBRK  (via drill 0.6)
  Top 0.203: U$1.4 72.9,63.5 61.21,75.18 57.53,75.18 v55.5,77.22 | v46.61,81.79 46.61,86.87 v46.48,87 | v47.37,92.58 50.04,92.58 v50.16,92.71 | v52.45,93.6 54.74,93.6 v58.67,97.54
  Top 0.254: U$1.4 73.84,63.32 73.84,58.52 J1.9
  Bottom 0.203: v55.5,77.22 55.5,78.87 52.96,81.41 46.99,81.41 v46.61,81.79 | v46.48,87 46.48,91.31 46.74,91.57 46.74,91.95 v47.37,92.58 | v50.16,92.71 51.56,92.71 v52.45,93.6 | v58.67,97.54 59.05,97.54 59.31,97.79 62.23,97.79 LF.P$4
LFDIR  (via drill 0.61)
  Top 0.254: U$1.3 71.09,63.32 71.09,58.52 J1.10 | v90.3,69.49 90.3,68.12 v91.21,67.21
  Bottom 0.254: v90.3,69.49 82.75,77.04 82.75,79.32 83.44,80.01 93.27,80.01 95.33,82.07 95.33,83.21 85.5,93.04 67.67,93.04 64.24,96.47 63.55,96.47 LF.P$3 | v91.21,67.21 83.44,67.21 80.01,63.78 80.01,63.09 79.32,62.41 72.24,62.41 71.32,63.32 U$1.3
LFENA  (via drill 0.61)
  Top 0.254: J1.11 U$1.2 | v60.58,87.1 59.66,88.01 59.66,97.16 60.81,98.3 60.81,98.98 LF.P$2
  Bottom 0.254: v60.58,87.1 60.58,84.12 59.66,83.21 59.66,72.47 68.58,63.55 U$1.2
LFSPEED
  Top 0.254: U$1.23/A9 J2.4 68.58,88.24 66.06,90.75 66.06,96.47 LF.P$5
N$1
  Top 0.254: U$1.12 93.95,63.32 93.95,58.52 J1.1
N$2
  Top 0.254: R12.S 20.12,97.61 20.12,96.01 16.69,92.58 16.69,87.33 R5.1 16.46,87.33 5.26,76.12 5.26,71.32 LM338.1
N$3
  Top 0.203: R18.1 88.01,36.07 89.28,37.34 89.28,41.02 88.65,41.66 88.65,44.2 89.66,45.21 94.61,45.21 96.65,47.24 97.66,47.24 97.66,48.13 T5.B
N$4
  Top 0.203: T2.B 74.93,42.8 77.34,40.39 87.38,40.39 87.76,40.77 87.76,44.58 89.53,46.35 93.34,46.35 T5.C
  Bottom 0.203: T2.B R7.1
N$5  (via drill 0.6)
  Top 0.203: v72.47,42.98 72.47,42.6 76.07,38.99 87.76,38.99 v88.27,39.5
  Bottom 0.203: v88.27,39.5 88.27,44.32 91.31,47.37 91.31,48.13 R17.1
  Bottom 0.254: U$2.GATEPAD 73.38,6.17 77.04,6.17 78.64,4.57 84.81,4.57 85.95,5.71 85.95,20.57 72.47,34.06 v72.47,42.98 T2.C
N$6  (via drill 0.6)
  Top 0.203: v19.05,39.37 19.05,24.13 T1.C
  Bottom 0.203: v19.05,39.37 16.51,41.91 U$3.P$5
  Bottom 0.254: T1.C 17.83,22.86 24.46,16.23 25.83,16.23 29.26,12.8 D1.A
N$8
  Top 0.203: T3.C 52.07,27.69 50.29,29.46 50.29,41.27 | 50.29,41.27 50.29,41.4 | U$4.P$5 52.32,43.31 50.29,41.27
  Top 0.254: T3.C 51.89,22.86 51.89,18.06 50.98,17.14 50.98,14.86 53.03,12.8 64.69,12.8 D3.A
N$9
  Top 0.254: R10.2 19.99,76.28 14.17,71.32 D4.A
N$10  (via drill 0.6)
  Top 0.203: v19.05,45.72 19.05,41.91 16.51,39.37 U$3.P$4
  Bottom 0.203: v19.05,45.72 11.43,45.72 7.62,49.53 7.62,50.8 8.89,52.07 12.7,52.07 R10.1
N$11
  Top 2.54: SOLENOID.1 83.86,26.71 78.74,21.59 U$2.COLLECTORPAD
  Bottom 0.254: D6.A 80.01,42.98 80.09,42.98 85.85,38.61 87.63,36.58 87.63,34.04 90.04,32.64 96.47,26.52 SOLENOID.1
N$12
  Top 0.254: LED1.A 52.12,84.81 52.12,86.64 R11.1
N$13
  Top 0.254: R13.2 61.27,53.26 61.27,50.75 61.26,49.5 | 10.86,57.72 13.95,60.81 D4.C | 90.3,31.75 90.3,42.98 D6.C
  Top 2.54: SOLENOID.2 96.52,31.75 90.3,31.75 68.58,31.75 68.58,49.49 67.35,49.49 61.26,49.5 36.83,49.53 31.75,52.07 11.43,52.07 11.43,57.15 10.86,57.72 7.62,60.96 5.12,60.96 CAPACITOR.1
N$14  (via drill 0.6, 0.61)
  Top 0.203: R15.2 72.26,53.34 v72.14,53.21 | v54.1,51.94 43.56,51.94 43.05,51.44 37.47,51.44 35.94,52.96 35.05,52.96 33.66,54.36 14.35,54.36 v13.72,54.99
  Top 0.254: v80.01,54.86 79.1,53.95 79.1,53.49 R15.2 | v92.35,54.86 v87.78,54.86 | v96.01,58.52 96.01,62.64 v96.47,63.09 | v96.47,75.89 96.47,82.75 80.47,98.75 77.04,98.75 74.98,96.7 UP-VOLT_REG.2
  Bottom 0.203: v72.14,53.21 71.37,52.96 70.48,51.31 54.74,51.31 v54.1,51.94 | v13.72,54.99 10.67,54.99 6.86,51.18 6.86,49.15 11.43,44.58 14.22,44.58 14.48,44.83 22.1,44.83 | 22.1,44.83 22.16,44.83 | U$3.P$1 22.51,45.24 22.1,44.83
  Bottom 0.254: v87.78,54.86 v80.01,54.86 | v96.01,58.52 v92.35,54.86 | v96.47,75.89 v96.47,63.09
N$15
  Top 0.254: R6.1 17.83,15.32 17.83,20.57 20.12,22.86 T1.B
N$17
  Top 0.254: LED2.A 48.23,84.81 48.23,86.64 R1.2
N$18
  Top 0.254: U$1.AGND 63.55,78.87 63.55,80.24 65.84,82.53 J2.3
N$19
  Top 0.254: LED3.A 44.58,84.81 44.58,86.64 R3.2
N$20
  Top 0.254: R8.1 52.12,15.32 52.12,17.6 54.41,19.89 54.41,22.86 T3.B
N$22  (via drill 0.6)
  Top 0.203: DRIBBLER.1 96.43,15.28 v91.95,10.79 | v81.28,33.78 70.74,33.78 v70.61,33.91 | v59.94,34.67 59.94,43.31 59.09,44.16 U$4.P$1
  Bottom 0.203: v91.95,10.79 87,15.75 87,20.7 83.95,23.75 83.95,26.16 81.41,28.7 81.41,33.66 v81.28,33.78 | v70.61,33.91 60.71,33.91 v59.94,34.67
N$24
  Top 0.203: T4.C 34.29,27.94 32.77,29.46 32.77,41.66 34.42,43.31 U$5.P$5
  Top 0.254: T4.C 34.29,18.29 33.15,17.14 33.15,14.86 35.2,12.8 46.86,12.8 D5.A
N$26
  Top 0.254: R9.1 34.29,17.6 36.8,20.12 36.8,22.86 T4.B
N$28  (via drill 0.6)
  Top 0.203: v88.14,37.85 71.25,37.85 v71.5,38.1
  Bottom 0.203: CHIPPER.1 88.43,38.14 v88.14,37.85 | v71.5,38.1 48.39,38.1 | 48.39,38.1 48.26,38.1 | U$5.P$1 41.18,45.31 48.39,38.1
N$43
  Top 0.254: LED4.A 39.55,84.81 39.55,86.64 R4.1
N$139
  Top 0.254: LED5.A 41.83,52.58 39.55,52.58 R2.1
P13
  Top 0.254: U$1.13 93.95,78.87 93.95,82.53 J2.14
PROG
  Top 0.254: U$1.PGM 93.95,73.84 87.1,73.84 82.53,78.41 82.53,79.32 80.01,81.84 80.01,83.21 75.67,87.55 74.98,87.55 JP5.4
PWR_CHARGE  (1 unrouted)
PWR_CHIP  (1 unrouted)
PWR_DISCHARGE  (1 unrouted)
PWR_DRIBBLE  (1 unrouted)
PWR_GND  (5 unrouted)
  Top 0.203: T3.E 57.15,25.9 53.09,29.96
PWR_READ_250  (1 unrouted)
  Top 0.254: R15.1 81.15,53.26 85.27,53.26 R16.2
PWR_READ_CAP  (2 unrouted)
PWR_VCC  (2 unrouted)
  Top 0.254: C4.1 22.86,92.81 28.8,98.75 32,98.75 34.06,96.7
  Bottom 0.254: 34.06,96.47 34.06,95.1 18.41,77.72 12.01,71.32 10.29,71.32 LM338.3
RBBRK  (via drill 0.61)
  Top 0.254: J2.13 U$1.14/A0 | v58.75,89.84 v39.78,89.84 | v65.15,92.58 v61.49,92.58
  Bottom 0.254: v39.78,89.84 9.6,59.66 5.49,59.66 2.29,56.46 2.29,18.06 9.37,10.97 39.09,10.97 44.81,5.26 45.72,5.26 RB.P$4 | v61.49,92.58 v58.75,89.84 | v65.15,92.58 75.67,92.58 84.35,83.9 90.3,83.9 91.44,82.75 J2.13
RBDIR
  Top 0.254: U$1.15/A1 88.92,78.87 88.92,82.53 J2.12
  Bottom 0.254: RB.P$3 45.72,2.52 46.41,2.52 47.78,1.14 84.84,1.14 94.11,10.54 94.11,12.57 94.18,12.57 94.18,21.03 99.67,26.52 99.67,74.07 96.24,77.5 90.07,77.5 88.92,78.64 U$1.15/A1
RBENA  (via drill 0.61)
  Top 0.254: U$1.16/A2 86.41,78.87 86.41,82.53 J2.11 | v56.01,6.4 45.26,6.4 44.12,5.26 43.2,5.26 RB.P$2
  Bottom 0.254: v56.01,6.4 71.32,6.4 73.61,4.12 86.94,4.12 93.6,11.02 93.73,21.26 99.21,26.75 99.21,58.98 95.56,62.64 95.56,71.09 94.18,72.47 92.58,72.47 86.41,78.64 U$1.16/A2
RBSPEED  (via drill 0.61)
  Top 0.254: v75.89,21.95 83.44,29.49 97.84,29.49 99.21,30.86 99.21,61.72 96.01,64.92 90.07,64.92 76.35,78.64 U$1.20/A6
  Bottom 0.254: U$1.20/A6 76.35,78.87 76.35,82.53 J2.7 | v75.89,21.95 69.49,21.95 50.29,2.74 48.46,2.74 RB.P$5
READ_250  (1 unrouted)
  Top 0.254: 80.92,53.49 80.92,55.32 80.01,56.24 80.01,63.78 73.84,69.95 73.84,76.12 U$1.A11
READ_CAP  (via drill 0.61)  (1 unrouted)
  Top 0.254: 67.44,53.26 v66.06,53.26 63.32,53.26 | v77.95,60.58 77.5,61.04 77.5,63.78 71.32,69.95 71.32,76.12 U$1.A10
  Bottom 0.254: v77.95,60.58 78.41,60.58 80.01,58.98 80.01,57.33 77.85,55.42 68.38,55.42 68.07,55.5 v66.06,53.26
RESET  (via drill 0.61)
  Top 0.254: v50.75,90.75 56.69,90.75 S3.1
  Bottom 0.254: v50.75,90.75 50.75,89.15 41.38,79.78 JP1.5
RFBRK  (via drill 0.61)
  Top 0.254: U$1.17/A3 83.9,78.87 83.9,82.53 J2.10 | v97.38,28.57 83.44,28.57 77.04,22.17 77.04,21.72 66.29,10.97 63.78,10.97 58.06,5.26 57.15,5.26 RF.P$4
  Bottom 0.254: v97.38,28.57 97.38,29.72 98.75,31.09 98.75,58.75 95.1,62.41 95.1,69.04 94.18,69.95 92.58,69.95 83.9,78.64 U$1.17/A3
RFDIR  (via drill 0.61)
  Top 0.254: v75.67,91.21 73.61,93.27 73.61,97.84 74.98,99.21 80.7,99.21 100.13,79.78 100.13,20.34 98.3,18.52 96.93,18.52 94.18,15.77 94.18,14.4 80.92,1.14 59.21,1.14 57.84,2.52 57.15,2.52 RF.P$3
  Bottom 0.254: U$1.18/A4 81.38,78.87 81.38,82.53 J2.9 81.15,82.75 81.15,85.95 78.18,88.92 77.95,88.92 v75.67,91.21
RFENA  (via drill 0.61)
  Top 0.254: v80.01,27.89 v73.15,21.03
  Bottom 0.254: J2.8 78.87,82.53 78.87,78.87 U$1.19/A5 78.87,78.64 78.87,76.81 87.55,68.12 91.67,68.12 92.58,67.21 92.58,63.32 96.93,58.98 96.93,58.06 85.5,46.63 81.61,46.63 78.64,43.66 78.64,42.75 78.11,40.74 75.18,40.77 74.93,40.51 74.93,34.8 80.01,29.72 v80.01,27.89 | v73.15,21.03 69.27,21.03 54.63,6.4 54.63,5.26 RF.P$2
RFSPEED
  Top 0.254: 73.84,80.01 73.84,82.53 J2.6 | 73.84,80.01 73.84,78.87 U$1.21/A7 | 73.84,80.01 76.58,80.01 77.27,79.32 77.27,78.64 82.53,73.38 87.78,73.38 91.21,69.95 91.21,69.72 93.5,67.44 94.18,67.44 99.67,61.95 99.67,20.57 98.07,18.97 94.87,18.97 78.64,2.74 59.89,2.74 RF.P$5
RSSI
  Top 0.254: R4.2 39.55,88.47 40.23,87.78 40.23,80.7 39.32,79.78 JP1.6
UART_RX
  Top 0.254: LED2.C 48.23,82.75 48.23,80.7 47.32,79.78 JP1.2 | U$1.0 63.55,63.32 63.55,58.52 J1.13
  Bottom 0.254: U$1.0 62.41,62.41 60.35,62.41 47.32,75.44 47.32,79.55 JP1.2
UART_TX
  Top 0.254: LED3.C 44.58,82.75 44.58,80.24 45.03,79.78 JP1.3 | U$1.1 66.06,63.32 66.06,58.52 J1.12
  Bottom 0.254: JP1.3 45.26,79.55 45.26,76.81 60.12,61.95 64.47,61.95 65.84,63.32 U$1.1
VBAT  (via drill 0.61)
  Top 0.254: v84.58,72.47 90.98,66.06 93.95,66.06 U$1.VBAT | v67.67,84.81 67.67,87.33 67.44,87.55 JP5.1
  Bottom 0.254: v84.58,72.47 80.01,77.04 80.01,83.21 78.41,84.81 v67.67,84.81

### Text on the board
tPlace: + | + | FRONT | BACK | CHARGE | CHIPPER | DRIBBLER | + | DISCHARGE | +